# Altium schematic sheet Debug.SchDoc
size B; DocumentNumber: 8; SheetNumber: 8; SheetTotal: 9
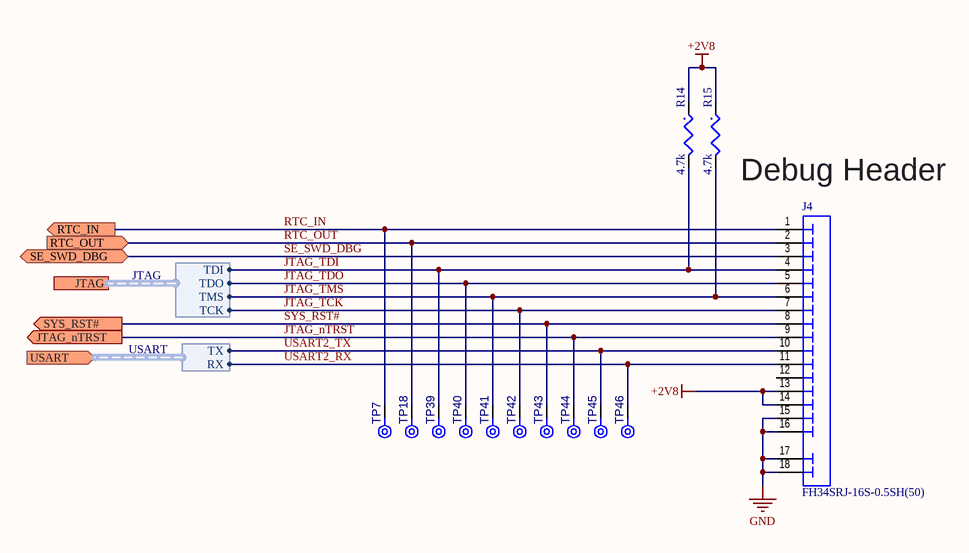
[diagram p0: Debug.SchDoc]

## Parts
J4  FH34SRJ-16S-0.5SH(50)  [HIRO - FH34SRJ-16S-0.5SH_V]
R14  Resistance: 4.7k  [RESC0402(1005)_L]  (hidden comment: RES 4.7K 1/16W 1% 0402)
R15  Resistance: 4.7k  [RESC0402(1005)_L]  (hidden comment: RES 4.7K 1/16W 1% 0402)
TP7  TPAD8R  [TP08R]  (value not drawn)  (no BOM)
TP18  TPAD8R  [TP08R]  (value not drawn)  (no BOM)
TP39  TPAD8R  [TP08R]  (value not drawn)  (no BOM)
TP40  TPAD8R  [TP08R]  (value not drawn)  (no BOM)
TP41  TPAD8R  [TP08R]  (value not drawn)  (no BOM)
TP42  TPAD8R  [TP08R]  (value not drawn)  (no BOM)
TP43  TPAD8R  [TP08R]  (value not drawn)  (no BOM)
TP44  TPAD8R  [TP08R]  (value not drawn)  (no BOM)
TP45  TPAD8R  [TP08R]  (value not drawn)  (no BOM)
TP46  TPAD8R  [TP08R]  (value not drawn)  (no BOM)

## Ports
JTAG (harness JTAG), JTAG_nTRST (out), RTC_IN (out), RTC_OUT (in), SE_SWD_DBG (bidir), SYS_RST# (out), USART (in, harness USART)

## Harnesses
JTAG: TCK, TDI, TDO, TMS
USART: TX, RX

## Nets
+2V8: J4.13 J4.14 R14.1 R15.1
GND: J4.15 J4.16 J4.17 J4.18
JTAG_nTRST: J4.9 TP44.1(TP) ; port JTAG_nTRST
JTAG_TCK: J4.7 TP42.1(TP) ; port JTAG.TCK
JTAG_TDI: J4.4 R14.2 TP39.1(TP) ; port JTAG.TDI
JTAG_TDO: J4.5 TP40.1(TP) ; port JTAG.TDO
JTAG_TMS: J4.6 R15.2 TP41.1(TP) ; port JTAG.TMS
RTC_IN: J4.1 TP7.1(TP) ; port RTC_IN
RTC_OUT: J4.2 TP18.1(TP) ; port RTC_OUT
SE_SWD_DBG: J4.3 ; port SE_SWD_DBG
SYS_RST#: J4.8 TP43.1(TP) ; port SYS_RST#
USART2_RX: J4.11 TP46.1(TP) ; port USART.RX
USART2_TX: J4.10 TP45.1(TP) ; port USART.TX

Not connected (* = marked no-connect by the designer): J4 12

## Notes on the sheet
- Debug Header
- Drawing Title:
- Page Title:
- Size:
- B
- Document Number
- Variant:
- Rev:
- Date:
- Sheet:
- of

## Library data of the parts
J4 = CMP-CON-0062-2: 16 Position FFC, FPC Connector Contacts, Top and Bottom 0.020" (0.50mm) Surface Mount, Right Angle; Connector Type: CARD EDGE CONNECTOR; RoHS Compliant: Yes; Manufacturer Series: FH34SRJ; REACH SVHC: Yes
R14 R15 = CMP-RES-00002-3: 4.7 kOhms ±1% 0.063W, 1/16W Chip Resistor 0402 (1005 Metric) Automotive AEC-Q200 Thick Film; Max Power Dissipation: 63mW; Voltage Rating (DC): 50V; Temperature Coefficient: 100ppm/°C; Weight: 2.3E-05oz; Package Quantity: 10; Military Standard: Not; Contact Plating: Tin; Termination: SMD/SMT; Max Operating Temperature: 155°C; Case Code (Metric): 1005; Case Code (Imperial): 0402; Features: Automotive AEC-Q200; Power Rating: 63mW; REACH SVHC: Unknown; Min Operating Temperature: -55°C; Tolerance: 1%; Mount: Surface Mount; Width: 0.5mm; Depth: 0.5mm; Radiation Hardening: No; Length: 1mm; Number of Terminations: 2; Case/Package: 0402; Voltage Rating: 50V; Height: 0.35mm; Packaging: Tape and Reel; Lead Free: Lead Free; Composition: Thick Film
TP7 TP18 TP39-TP46 = CMP-MECH-00011-2: 0.8mm round; Pins: 1